# Altium schematic sheet LongLedPcb.SchDoc
size A3; Organization: Altium Limited; Address1: L3, 12a Rodborough Rd; Address2: Frenchs Forest; Address3: NSW; Address4: Australia 2086; DocumentNumber: 1; SheetNumber: 1; SheetTotal: 1
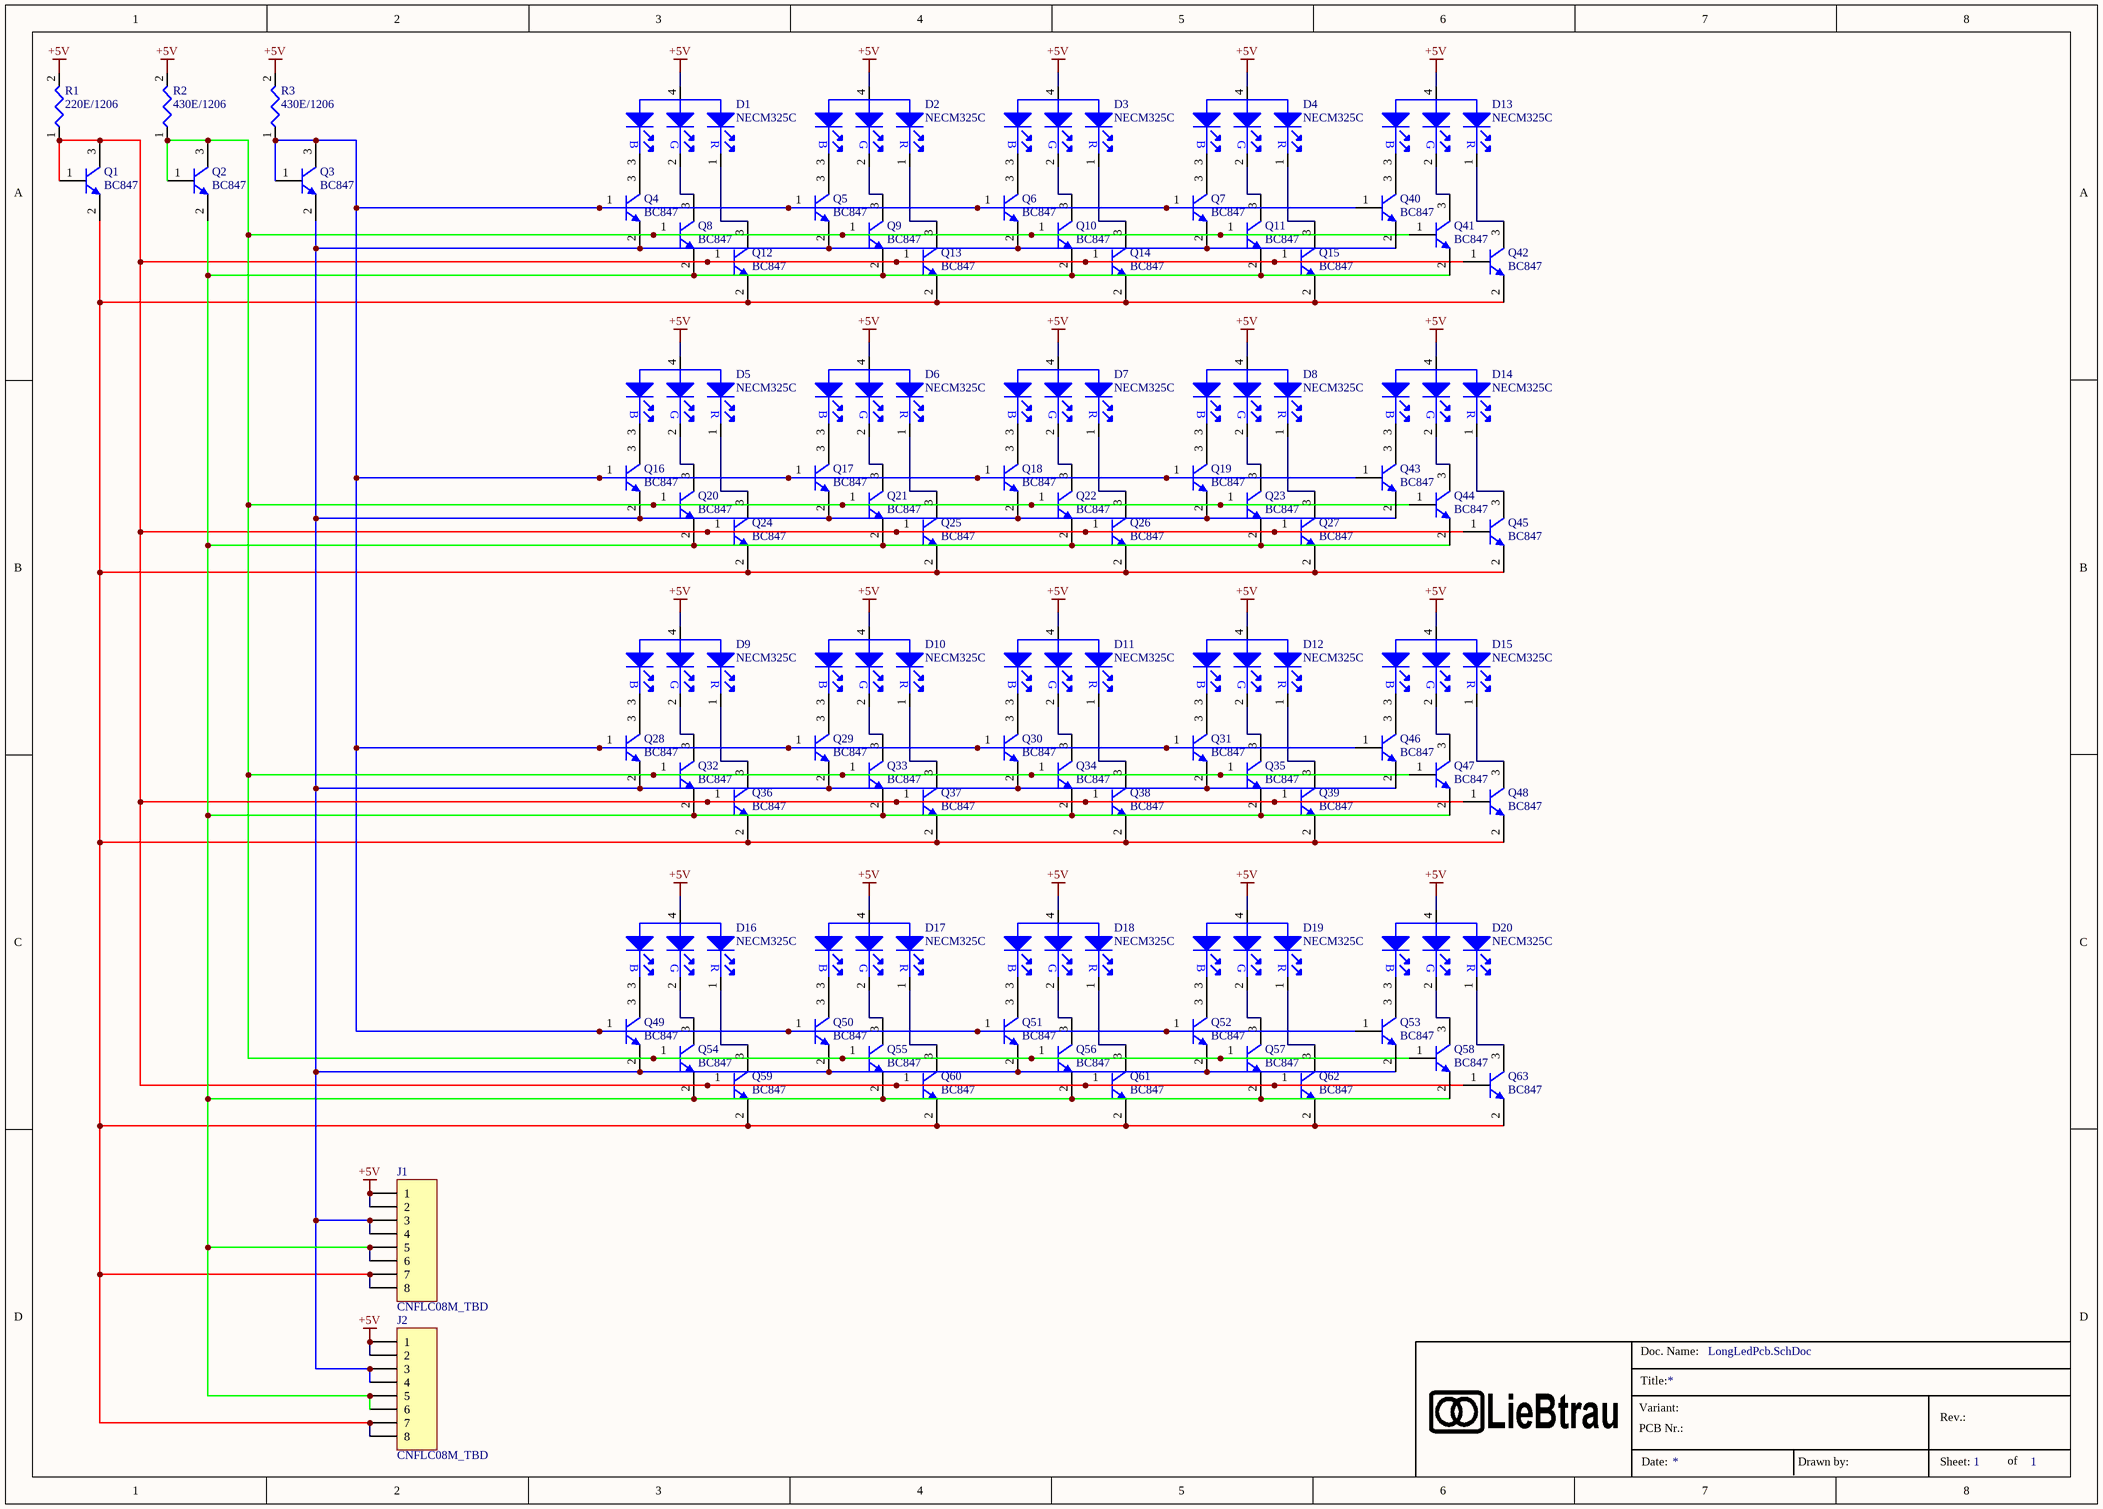
[diagram p0: LongLedPcb.SchDoc]

## Parts
D1  NECM325C  [D_PLCC4]
D2  NECM325C  [D_PLCC4]
D3  NECM325C  [D_PLCC4]
D4  NECM325C  [D_PLCC4]
D5  NECM325C  [D_PLCC4]
D6  NECM325C  [D_PLCC4]
D7  NECM325C  [D_PLCC4]
D8  NECM325C  [D_PLCC4]
D9  NECM325C  [D_PLCC4]
D10  NECM325C  [D_PLCC4]
D11  NECM325C  [D_PLCC4]
D12  NECM325C  [D_PLCC4]
D13  NECM325C  [D_PLCC4]
D14  NECM325C  [D_PLCC4]
D15  NECM325C  [D_PLCC4]
D16  NECM325C  [D_PLCC4]
D17  NECM325C  [D_PLCC4]
D18  NECM325C  [D_PLCC4]
D19  NECM325C  [D_PLCC4]
D20  NECM325C  [D_PLCC4]
J1  CNFLC08M_TBD  [J_215079-8]
J2  CNFLC08M_TBD  [J_215079-8]
Q1  BC847  [SOT23]
Q2  BC847  [SOT23]
Q3  BC847  [SOT23]
Q4  BC847  [SOT23]
Q5  BC847  [SOT23]
Q6  BC847  [SOT23]
Q7  BC847  [SOT23]
Q8  BC847  [SOT23]
Q9  BC847  [SOT23]
Q10  BC847  [SOT23]
Q11  BC847  [SOT23]
Q12  BC847  [SOT23]
Q13  BC847  [SOT23]
Q14  BC847  [SOT23]
Q15  BC847  [SOT23]
Q16  BC847  [SOT23]
Q17  BC847  [SOT23]
Q18  BC847  [SOT23]
Q19  BC847  [SOT23]
Q20  BC847  [SOT23]
Q21  BC847  [SOT23]
Q22  BC847  [SOT23]
Q23  BC847  [SOT23]
Q24  BC847  [SOT23]
Q25  BC847  [SOT23]
Q26  BC847  [SOT23]
Q27  BC847  [SOT23]
Q28  BC847  [SOT23]
Q29  BC847  [SOT23]
Q30  BC847  [SOT23]
Q31  BC847  [SOT23]
Q32  BC847  [SOT23]
Q33  BC847  [SOT23]
Q34  BC847  [SOT23]
Q35  BC847  [SOT23]
Q36  BC847  [SOT23]
Q37  BC847  [SOT23]
Q38  BC847  [SOT23]
Q39  BC847  [SOT23]
Q40  BC847  [SOT23]
Q41  BC847  [SOT23]
Q42  BC847  [SOT23]
Q43  BC847  [SOT23]
Q44  BC847  [SOT23]
Q45  BC847  [SOT23]
Q46  BC847  [SOT23]
Q47  BC847  [SOT23]
Q48  BC847  [SOT23]
Q49  BC847  [SOT23]
Q50  BC847  [SOT23]
Q51  BC847  [SOT23]
Q52  BC847  [SOT23]
Q53  BC847  [SOT23]
Q54  BC847  [SOT23]
Q55  BC847  [SOT23]
Q56  BC847  [SOT23]
Q57  BC847  [SOT23]
Q58  BC847  [SOT23]
Q59  BC847  [SOT23]
Q60  BC847  [SOT23]
Q61  BC847  [SOT23]
Q62  BC847  [SOT23]
Q63  BC847  [SOT23]
R1  220E/1206  [R_1206]
R2  430E/1206  [R_1206]
R3  430E/1206  [R_1206]

## Nets
+5V: D1.4(A) D2.4(A) D3.4(A) D4.4(A) D5.4(A) D6.4(A) D7.4(A) D8.4(A) D9.4(A) D10.4(A) D11.4(A) D12.4(A) D13.4(A) D14.4(A) D15.4(A) D16.4(A) D17.4(A) D18.4(A) D19.4(A) D20.4(A) J1.1 J1.2 J2.1 J2.2 R1.2 R2.2 R3.2
NetD1_1: D1.1(C) Q12.3(E)
NetD1_2: D1.2(C) Q8.3(E)
NetD1_3: D1.3(C) Q4.3(E)
NetD2_1: D2.1(C) Q13.3(E)
NetD2_2: D2.2(C) Q9.3(E)
NetD2_3: D2.3(C) Q5.3(E)
NetD3_1: D3.1(C) Q14.3(E)
NetD3_2: D3.2(C) Q10.3(E)
NetD3_3: D3.3(C) Q6.3(E)
NetD4_1: D4.1(C) Q15.3(E)
NetD4_2: D4.2(C) Q11.3(E)
NetD4_3: D4.3(C) Q7.3(E)
NetD5_1: D5.1(C) Q24.3(E)
NetD5_2: D5.2(C) Q20.3(E)
NetD5_3: D5.3(C) Q16.3(E)
NetD6_1: D6.1(C) Q25.3(E)
NetD6_2: D6.2(C) Q21.3(E)
NetD6_3: D6.3(C) Q17.3(E)
NetD7_1: D7.1(C) Q26.3(E)
NetD7_2: D7.2(C) Q22.3(E)
NetD7_3: D7.3(C) Q18.3(E)
NetD8_1: D8.1(C) Q27.3(E)
NetD8_2: D8.2(C) Q23.3(E)
NetD8_3: D8.3(C) Q19.3(E)
NetD9_1: D9.1(C) Q36.3(E)
NetD9_2: D9.2(C) Q32.3(E)
NetD9_3: D9.3(C) Q28.3(E)
NetD10_1: D10.1(C) Q37.3(E)
NetD10_2: D10.2(C) Q33.3(E)
NetD10_3: D10.3(C) Q29.3(E)
NetD11_1: D11.1(C) Q38.3(E)
NetD11_2: D11.2(C) Q34.3(E)
NetD11_3: D11.3(C) Q30.3(E)
NetD12_1: D12.1(C) Q39.3(E)
NetD12_2: D12.2(C) Q35.3(E)
NetD12_3: D12.3(C) Q31.3(E)
NetD13_1: D13.1(C) Q42.3(E)
NetD13_2: D13.2(C) Q41.3(E)
NetD13_3: D13.3(C) Q40.3(E)
NetD14_1: D14.1(C) Q45.3(E)
NetD14_2: D14.2(C) Q44.3(E)
NetD14_3: D14.3(C) Q43.3(E)
NetD15_1: D15.1(C) Q48.3(E)
NetD15_2: D15.2(C) Q47.3(E)
NetD15_3: D15.3(C) Q46.3(E)
NetD16_1: D16.1(C) Q59.3(E)
NetD16_2: D16.2(C) Q54.3(E)
NetD16_3: D16.3(C) Q49.3(E)
NetD17_1: D17.1(C) Q60.3(E)
NetD17_2: D17.2(C) Q55.3(E)
NetD17_3: D17.3(C) Q50.3(E)
NetD18_1: D18.1(C) Q61.3(E)
NetD18_2: D18.2(C) Q56.3(E)
NetD18_3: D18.3(C) Q51.3(E)
NetD19_1: D19.1(C) Q62.3(E)
NetD19_2: D19.2(C) Q57.3(E)
NetD19_3: D19.3(C) Q52.3(E)
NetD20_1: D20.1(C) Q63.3(E)
NetD20_2: D20.2(C) Q58.3(E)
NetD20_3: D20.3(C) Q53.3(E)
NetJ1_3: J1.3 J1.4 J2.3 J2.4 Q3.2(B) Q4.2(B) Q5.2(B) Q6.2(B) Q7.2(B) Q16.2(B) Q17.2(B) Q18.2(B) Q19.2(B) Q28.2(B) Q29.2(B) Q30.2(B) Q31.2(B) Q40.2(B) Q43.2(B) Q46.2(B) Q49.2(B) Q50.2(B) Q51.2(B) Q52.2(B) Q53.2(B)
NetJ1_5: J1.5 J1.6 J2.5 J2.6 Q2.2(B) Q8.2(B) Q9.2(B) Q10.2(B) Q11.2(B) Q20.2(B) Q21.2(B) Q22.2(B) Q23.2(B) Q32.2(B) Q33.2(B) Q34.2(B) Q35.2(B) Q41.2(B) Q44.2(B) Q47.2(B) Q54.2(B) Q55.2(B) Q56.2(B) Q57.2(B) Q58.2(B)
NetJ1_7: J1.7 J1.8 J2.7 J2.8 Q1.2(B) Q12.2(B) Q13.2(B) Q14.2(B) Q15.2(B) Q24.2(B) Q25.2(B) Q26.2(B) Q27.2(B) Q36.2(B) Q37.2(B) Q38.2(B) Q39.2(B) Q42.2(B) Q45.2(B) Q48.2(B) Q59.2(B) Q60.2(B) Q61.2(B) Q62.2(B) Q63.2(B)
NetQ1_1: Q1.1(C) Q1.3(E) Q12.1(C) Q13.1(C) Q14.1(C) Q15.1(C) Q24.1(C) Q25.1(C) Q26.1(C) Q27.1(C) Q36.1(C) Q37.1(C) Q38.1(C) Q39.1(C) Q42.1(C) Q45.1(C) Q48.1(C) Q59.1(C) Q60.1(C) Q61.1(C) Q62.1(C) Q63.1(C) R1.1
NetQ2_1: Q2.1(C) Q2.3(E) Q8.1(C) Q9.1(C) Q10.1(C) Q11.1(C) Q20.1(C) Q21.1(C) Q22.1(C) Q23.1(C) Q32.1(C) Q33.1(C) Q34.1(C) Q35.1(C) Q41.1(C) Q44.1(C) Q47.1(C) Q54.1(C) Q55.1(C) Q56.1(C) Q57.1(C) Q58.1(C) R2.1
NetQ3_1: Q3.1(C) Q3.3(E) Q4.1(C) Q5.1(C) Q6.1(C) Q7.1(C) Q16.1(C) Q17.1(C) Q18.1(C) Q19.1(C) Q28.1(C) Q29.1(C) Q30.1(C) Q31.1(C) Q40.1(C) Q43.1(C) Q46.1(C) Q49.1(C) Q50.1(C) Q51.1(C) Q52.1(C) Q53.1(C) R3.1

## Notes on the sheet
- Title:
- Doc. Name:
- Variant:
- PCB Nr.:
- Date:
- Drawn by:
- Rev.:
- Sheet:
- of
- (in symbol NECM325C) B; G; R

## Library data of the parts
D1-D20 = NECM325C: Manufacturer: Nichia; Part Number: NECM325C; Component Type: led
J1 J2 = CNFLC08F_TBD: *; Order Code: Farnell 1641857; Part Number: CNFLC08F_TBD; Component Type: connector
Q1-Q63 = BC847: Amplifier Transistor NPN Silicon; Part Number: BC847; Component Type: transistor
R1 = YRES220_1206: Resistor; Manufacturer: Yageo (Phycomp); Order Code: Farnell 9240446; Part Number: YRES220_1206; Component Type: resistor
R2 R3 = YRES430E_TBD: Resistor; Manufacturer: Welwyn; Order Code: Farnell 1100182; Part Number: YRES430E_TBD; Component Type: resistor